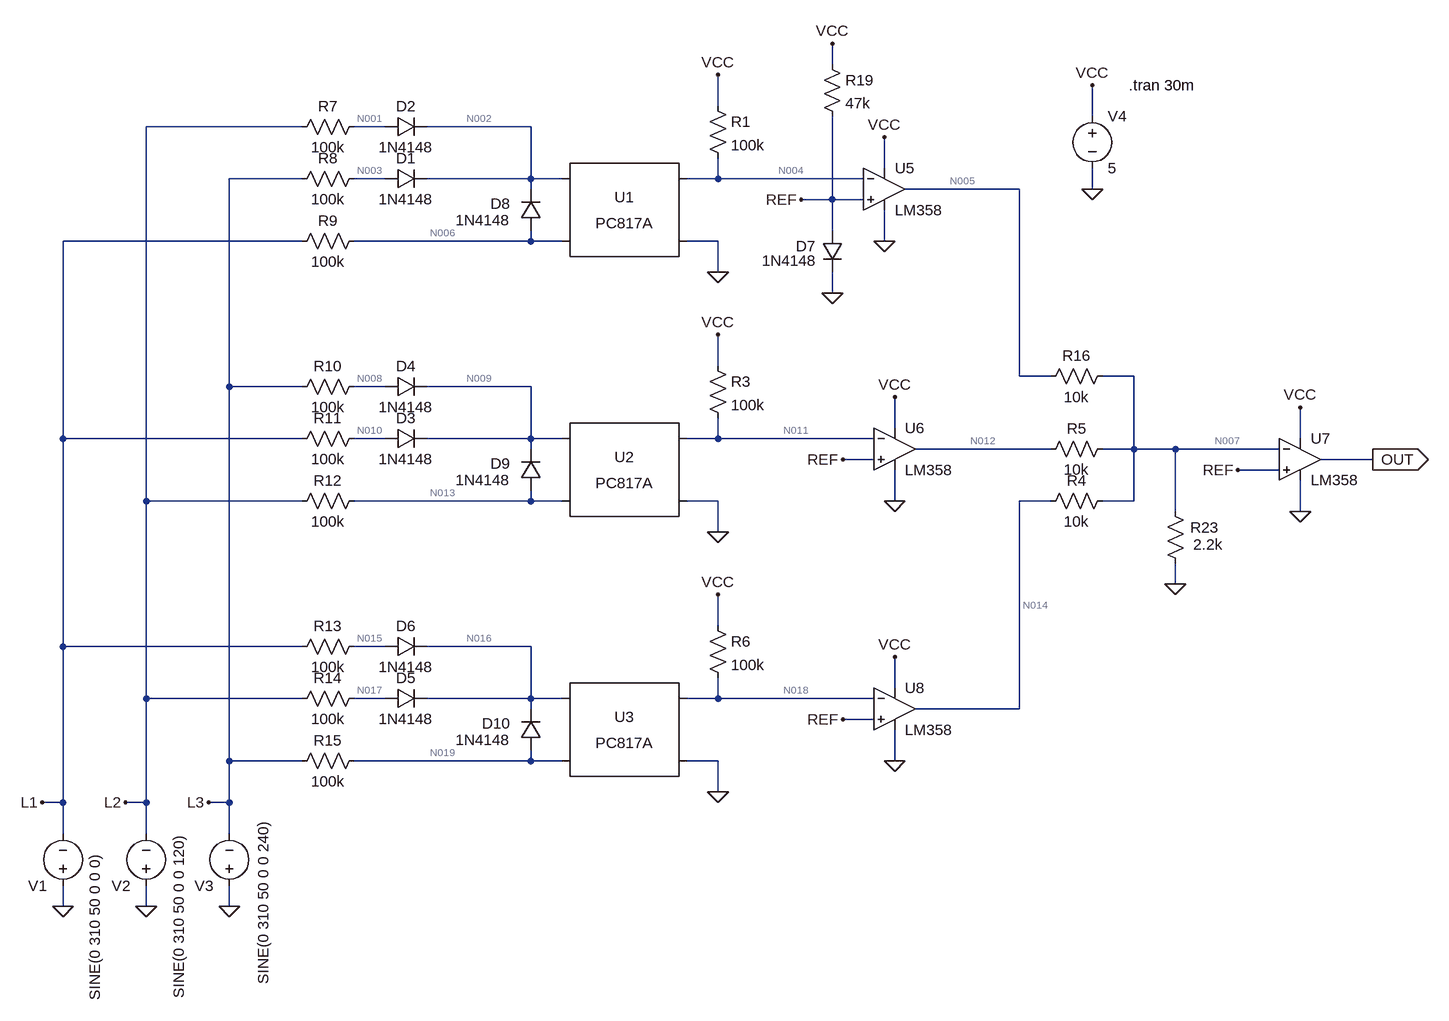
[diagram p0: schematic v1.0.asc]
* v1.0.asc
V1 0 L1 SINE(0 310 50 0 0 0)
V2 0 L2 SINE(0 310 50 0 0 120)
V3 0 L3 SINE(0 310 50 0 0 240)
X§U1 N002 N006 N004 0 PC817 Igain=1m
R1 VCC N004 100k
V4 VCC 0 5
D1 N003 N002 1N4148
D2 N001 N002 1N4148
X§U2 N009 N013 N011 0 PC817 Igain=1m
R3 VCC N011 100k
D3 N010 N009 1N4148
D4 N008 N009 1N4148
X§U3 N016 N019 N018 0 PC817 Igain=1m
R6 VCC N018 100k
D5 N017 N016 1N4148
D6 N015 N016 1N4148
R7 N001 L2 100k
R8 N003 L3 100k
R9 N006 L1 100k
R10 N008 L3 100k
R11 N010 L1 100k
R12 N013 L2 100k
R13 N015 L1 100k
R14 N017 L2 100k
R15 N019 L3 100k
R4 N007 N014 10k
R5 N007 N012 10k
R16 N007 N005 10k
D7 REF 0 1N4148
R19 VCC REF 47k
R23 0 N007 2.2k
D8 N006 N002 1N4148
D9 N013 N009 1N4148
D10 N019 N016 1N4148
* U5: LM358 (symbol MyLib\OpAmp\LM358 not available, pins judged from their places): In+=REF In-=N004 V+=VCC V-=0 OUT=N005
* U6: LM358 (symbol MyLib\OpAmp\LM358 not available, pins judged from their places): In+=REF In-=N011 V+=VCC V-=0 OUT=N012
* U7: LM358 (symbol MyLib\OpAmp\LM358 not available, pins judged from their places): In+=REF In-=N007 V+=VCC V-=0 OUT=OUT
* U8: LM358 (symbol MyLib\OpAmp\LM358 not available, pins judged from their places): In+=REF In-=N018 V+=VCC V-=0 OUT=N014
.model D D
.lib standard.dio
.tran 30m
.lib PC817.sub
.backanno
.end

* Results of the author's LTspice run, read from the files saved beside the schematic
* Operating Point, zero values left out:
*   V(l2) = -268.5 V
*   V(l3) = 268.5 V
*   V(n001) = -268.5 V
*   V(n002) = 134.4 V
*   V(n003) = 135 V
*   V(n004) = 79.09 mV
*   V(n005) = 21.64 mV
*   V(n006) = 133.4 V
*   V(n007) = 472.7 mV
*   V(n008) = 836.7 mV
*   V(n009) = 206.4 mV
*   V(n010) = 249.4 µV
*   V(n011) = 61.29 mV
*   V(n012) = 21.64 mV
*   V(n013) = -836.9 mV
*   V(n014) = 3.523 V
*   V(n015) = 278.8 µV
*   V(n016) = 268.4 V
*   V(n017) = -268.5 V
*   V(n018) = 5 V
*   V(n019) = 268.5 V
*   V(out) = 85.07 mV
*   V(ref) = 478.1 mV
*   V(vcc) = 5 V
*   I(D1) = 1.334 mA
*   I(D10) = 5.845 nA
*   I(D2) = -2.923 nA
*   I(D3) = -2.494 nA
*   I(D4) = 2.676 mA
*   I(D5) = -3.057 nA
*   I(D6) = -2.788 nA
*   I(D7) = 96.24 µA
*   I(D8) = -2.521 nA
*   I(D9) = -2.521 nA
*   I(R1) = 49.21 µA
*   I(R10) = -2.676 mA
*   I(R11) = 2.494 nA
*   I(R12) = 2.676 mA
*   I(R13) = 2.788 nA
*   I(R14) = 3.057 nA
*   I(R15) = -5.845 nA
*   I(R16) = 45.1 µA
*   I(R19) = 96.21 µA
*   I(R23) = -214.9 µA
*   I(R3) = 49.39 µA
*   I(R4) = -305 µA
*   I(R5) = 45.1 µA
*   I(R6) = 15.59 pA
*   I(R7) = 2.923 nA
*   I(R8) = -1.334 mA
*   I(R9) = 1.334 mA
*   I(V1) = -1.334 mA
*   I(V2) = -2.676 mA
*   I(V3) = 4.011 mA
*   I(V4) = 2.04 mA
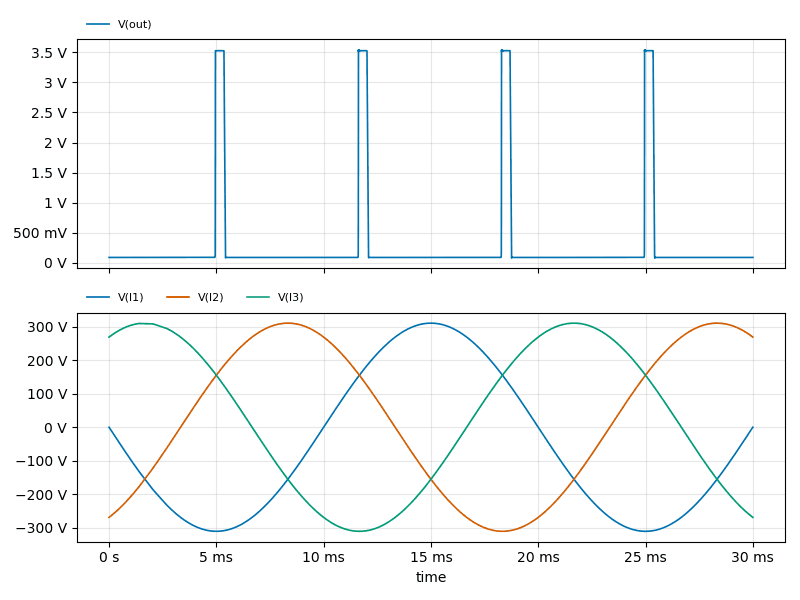
[diagram p1: Transient Analysis of v1.0.asc, plotted from the saved traces]
* Transient Analysis, 1 run:
*   V(out): min 75.54 mV, max 3.543 V, average 285.3 mV, rms 843.4 mV, last 85.07 mV
*   V(l1): min -310 V, max 310 V, average -65.75 V, rms 219.2 V, last 0 V
*   V(l2): min -310 V, max 310 V, average 32.91 V, rms 219.3 V, last 268.5 V
*   V(l3): min -310 V, max 310 V, average 32.84 V, rms 219.1 V, last -268.5 V